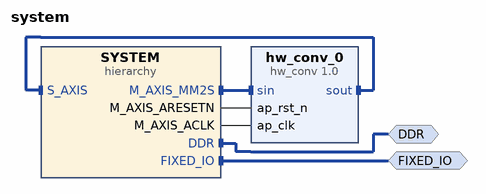
[diagram p0: block diagram of the top level]
# Vivado block design system, xc7z020clg400-1, Vivado 2018.3
create_bd_design system

create_bd_intf_port -mode Master -vlnv xilinx.com:interface:ddrx_rtl:1.0 DDR
create_bd_intf_port -mode Master -vlnv xilinx.com:display_processing_system7:fixedio_rtl:1.0 FIXED_IO

create_bd_cell -type hier SYSTEM
create_bd_cell -type ip -vlnv xilinx.com:hls:hw_conv:1.0 hw_conv_0

# ---- hierarchy /SYSTEM ----
current_bd_instance /SYSTEM
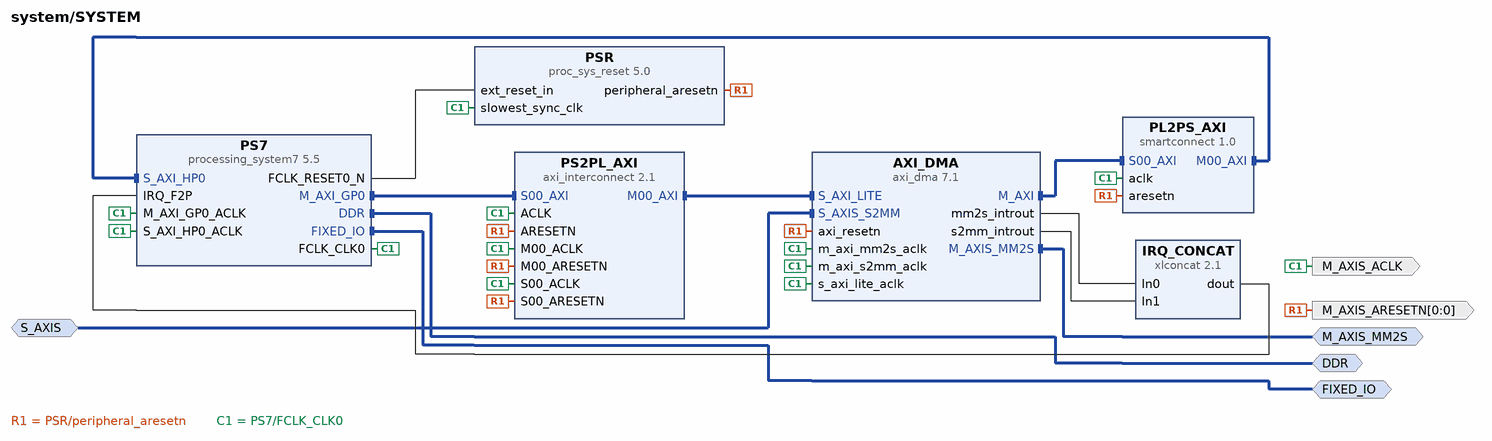
[diagram p1: block diagram inside /SYSTEM]
create_bd_intf_pin -mode Master -vlnv xilinx.com:interface:ddrx_rtl:1.0 DDR
create_bd_intf_pin -mode Master -vlnv xilinx.com:display_processing_system7:fixedio_rtl:1.0 FIXED_IO
create_bd_intf_pin -mode Master -vlnv xilinx.com:interface:axis_rtl:1.0 M_AXIS_MM2S
create_bd_intf_pin -mode Slave -vlnv xilinx.com:interface:axis_rtl:1.0 S_AXIS
create_bd_pin -dir O -type clk M_AXIS_ACLK
create_bd_pin -dir O -from 0 -to 0 -type rst M_AXIS_ARESETN

create_bd_cell -type ip -vlnv xilinx.com:ip:axi_dma:7.1 AXI_DMA
set_property -dict [list \
  CONFIG.c_include_sg 0 \
  CONFIG.c_m_axi_mm2s_data_width 64 \
  CONFIG.c_m_axi_s2mm_data_width 64 \
  CONFIG.c_m_axis_mm2s_tdata_width 8 \
  CONFIG.c_mm2s_burst_size 256 \
  CONFIG.c_s2mm_burst_size 256 \
  CONFIG.c_sg_length_width 26 \
  CONFIG.c_single_interface 1 \
] [get_bd_cells AXI_DMA]
create_bd_cell -type ip -vlnv xilinx.com:ip:xlconcat:2.1 IRQ_CONCAT
create_bd_cell -type ip -vlnv xilinx.com:ip:smartconnect:1.0 PL2PS_AXI
set_property -dict {CONFIG.NUM_SI 1} [get_bd_cells PL2PS_AXI]
create_bd_cell -type ip -vlnv xilinx.com:ip:axi_interconnect:2.1 PS2PL_AXI
set_property -dict {CONFIG.NUM_MI 1} [get_bd_cells PS2PL_AXI]
create_bd_cell -type ip -vlnv xilinx.com:ip:processing_system7:5.5 PS7
set_property -dict [list \
  CONFIG.PCW_APU_PERIPHERAL_FREQMHZ 650 \
  CONFIG.PCW_CRYSTAL_PERIPHERAL_FREQMHZ 50 \
  CONFIG.PCW_ENET0_ENET0_IO {MIO 16 .. 27} \
  CONFIG.PCW_ENET0_GRP_MDIO_ENABLE 1 \
  CONFIG.PCW_ENET0_GRP_MDIO_IO {MIO 52 .. 53} \
  CONFIG.PCW_ENET0_PERIPHERAL_ENABLE 1 \
  CONFIG.PCW_ENET0_RESET_ENABLE 1 \
  CONFIG.PCW_ENET0_RESET_IO {MIO 9} \
  CONFIG.PCW_ENET_RESET_ENABLE 1 \
  CONFIG.PCW_ENET_RESET_SELECT {Share reset pin} \
  CONFIG.PCW_FPGA0_PERIPHERAL_FREQMHZ 100 \
  CONFIG.PCW_FPGA1_PERIPHERAL_FREQMHZ 50 \
  CONFIG.PCW_GPIO_MIO_GPIO_ENABLE 1 \
  CONFIG.PCW_GPIO_MIO_GPIO_IO MIO \
  CONFIG.PCW_I2C_RESET_ENABLE 1 \
  CONFIG.PCW_IRQ_F2P_INTR 1 \
  CONFIG.PCW_PERIPHERAL_BOARD_PRESET None \
  CONFIG.PCW_PRESET_BANK1_VOLTAGE {LVCMOS 1.8V} \
  CONFIG.PCW_QSPI_GRP_FBCLK_ENABLE 1 \
  CONFIG.PCW_QSPI_GRP_FBCLK_IO {MIO 8} \
  CONFIG.PCW_QSPI_GRP_SINGLE_SS_ENABLE 1 \
  CONFIG.PCW_QSPI_GRP_SINGLE_SS_IO {MIO 1 .. 6} \
  CONFIG.PCW_QSPI_PERIPHERAL_ENABLE 1 \
  CONFIG.PCW_QSPI_QSPI_IO {MIO 1 .. 6} \
  CONFIG.PCW_SD0_GRP_CD_ENABLE 1 \
  CONFIG.PCW_SD0_GRP_CD_IO {MIO 47} \
  CONFIG.PCW_SD0_GRP_WP_ENABLE 0 \
  CONFIG.PCW_SD0_PERIPHERAL_ENABLE 1 \
  CONFIG.PCW_SD0_SD0_IO {MIO 40 .. 45} \
  CONFIG.PCW_SDIO_PERIPHERAL_FREQMHZ 50 \
  CONFIG.PCW_SINGLE_QSPI_DATA_MODE x4 \
  CONFIG.PCW_UART0_PERIPHERAL_ENABLE 1 \
  CONFIG.PCW_UART0_UART0_IO {MIO 14 .. 15} \
  CONFIG.PCW_UART1_PERIPHERAL_ENABLE 0 \
  CONFIG.PCW_UART_PERIPHERAL_FREQMHZ 100 \
  CONFIG.PCW_UIPARAM_DDR_BUS_WIDTH {16 Bit} \
  CONFIG.PCW_UIPARAM_DDR_FREQ_MHZ 525 \
  CONFIG.PCW_UIPARAM_DDR_PARTNO {MT41J256M16 RE-125} \
  CONFIG.PCW_USB0_PERIPHERAL_ENABLE 1 \
  CONFIG.PCW_USB0_RESET_ENABLE 1 \
  CONFIG.PCW_USB0_RESET_IO {MIO 46} \
  CONFIG.PCW_USB0_USB0_IO {MIO 28 .. 39} \
  CONFIG.PCW_USB_RESET_ENABLE 1 \
  CONFIG.PCW_USB_RESET_SELECT {Share reset pin} \
  CONFIG.PCW_USE_FABRIC_INTERRUPT 1 \
  CONFIG.PCW_USE_S_AXI_HP0 1 \
] [get_bd_cells PS7]
# 492 more settings of PS7 are not shown: defaults, MIO pin electricals, DDR timing, and values the tool derives
create_bd_cell -type ip -vlnv xilinx.com:ip:proc_sys_reset:5.0 PSR

# ---- connections ----

current_bd_instance /SYSTEM
connect_bd_intf_net [get_bd_intf_pins PS2PL_AXI/S00_AXI] [get_bd_intf_pins PS7/M_AXI_GP0]
connect_bd_intf_net [get_bd_intf_pins M_AXIS_MM2S] [get_bd_intf_pins AXI_DMA/M_AXIS_MM2S]
connect_bd_intf_net [get_bd_intf_pins AXI_DMA/M_AXI] [get_bd_intf_pins PL2PS_AXI/S00_AXI]
connect_bd_intf_net [get_bd_intf_pins AXI_DMA/S_AXI_LITE] [get_bd_intf_pins PS2PL_AXI/M00_AXI]
connect_bd_intf_net [get_bd_intf_pins DDR] [get_bd_intf_pins PS7/DDR]
connect_bd_intf_net -intf_net axi_smc_M00_AXI [get_bd_intf_pins PL2PS_AXI/M00_AXI] [get_bd_intf_pins PS7/S_AXI_HP0]
connect_bd_intf_net [get_bd_intf_pins FIXED_IO] [get_bd_intf_pins PS7/FIXED_IO]
connect_bd_intf_net [get_bd_intf_pins S_AXIS] [get_bd_intf_pins AXI_DMA/S_AXIS_S2MM]
connect_bd_net [get_bd_pins AXI_DMA/mm2s_introut] [get_bd_pins IRQ_CONCAT/In0]
connect_bd_net [get_bd_pins AXI_DMA/s2mm_introut] [get_bd_pins IRQ_CONCAT/In1]
connect_bd_net [get_bd_pins IRQ_CONCAT/dout] [get_bd_pins PS7/IRQ_F2P]
connect_bd_net -net M00_ARESETN_1 [get_bd_pins PSR/peripheral_aresetn] \
  [get_bd_pins M_AXIS_ARESETN] [get_bd_pins AXI_DMA/axi_resetn] [get_bd_pins PL2PS_AXI/aresetn] \
  [get_bd_pins PS2PL_AXI/ARESETN] [get_bd_pins PS2PL_AXI/M00_ARESETN] [get_bd_pins PS2PL_AXI/S00_ARESETN]
connect_bd_net [get_bd_pins PS7/FCLK_CLK0] \
  [get_bd_pins M_AXIS_ACLK] [get_bd_pins AXI_DMA/m_axi_mm2s_aclk] [get_bd_pins AXI_DMA/m_axi_s2mm_aclk] \
  [get_bd_pins AXI_DMA/s_axi_lite_aclk] [get_bd_pins PL2PS_AXI/aclk] [get_bd_pins PS2PL_AXI/ACLK] \
  [get_bd_pins PS2PL_AXI/M00_ACLK] [get_bd_pins PS2PL_AXI/S00_ACLK] [get_bd_pins PS7/M_AXI_GP0_ACLK] \
  [get_bd_pins PS7/S_AXI_HP0_ACLK] [get_bd_pins PSR/slowest_sync_clk]
connect_bd_net [get_bd_pins PS7/FCLK_RESET0_N] [get_bd_pins PSR/ext_reset_in]

current_bd_instance /
connect_bd_intf_net [get_bd_intf_ports DDR] [get_bd_intf_pins SYSTEM/DDR]
connect_bd_intf_net [get_bd_intf_ports FIXED_IO] [get_bd_intf_pins SYSTEM/FIXED_IO]
connect_bd_intf_net [get_bd_intf_pins hw_conv_0/sout] [get_bd_intf_pins SYSTEM/S_AXIS]
connect_bd_intf_net [get_bd_intf_pins hw_conv_0/sin] [get_bd_intf_pins SYSTEM/M_AXIS_MM2S]
connect_bd_net [get_bd_pins SYSTEM/M_AXIS_ARESETN] [get_bd_pins hw_conv_0/ap_rst_n]
connect_bd_net [get_bd_pins SYSTEM/M_AXIS_ACLK] [get_bd_pins hw_conv_0/ap_clk]

# ---- address map ----
assign_bd_address -offset 0x00000000 -range 512M -target_address_space [get_bd_addr_spaces SYSTEM/AXI_DMA/Data] [get_bd_addr_segs SYSTEM/PS7/S_AXI_HP0/HP0_DDR_LOWOCM]
assign_bd_address -offset 0x70000000 -range 64K -target_address_space [get_bd_addr_spaces SYSTEM/PS7/Data] [get_bd_addr_segs SYSTEM/AXI_DMA/S_AXI_LITE/Reg]

validate_bd_design
save_bd_design
